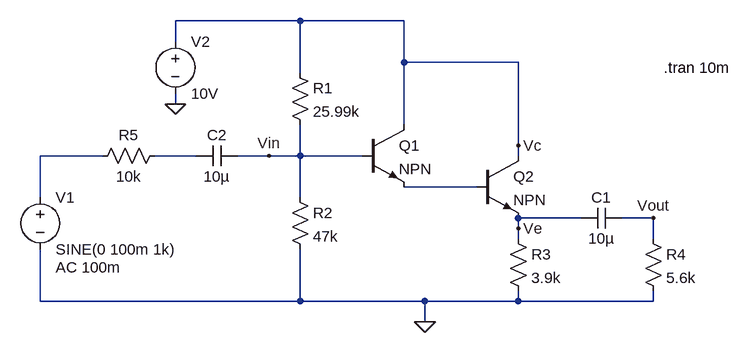
[diagram p0: schematic Darlington - Transient Analysis.asc]
Darlington - Transient Analysis.asc, the LTspice schematic file:
Version 4
SHEET 1 1452 680
WIRE 368 -64 176 -64
WIRE 528 -64 368 -64
WIRE 176 -32 176 -64
WIRE 528 0 528 -64
WIRE 704 0 528 0
WIRE 368 16 368 -64
WIRE 176 64 176 48
WIRE 528 96 528 0
WIRE 704 128 704 0
WIRE 64 144 -32 144
WIRE 208 144 144 144
WIRE 320 144 272 144
WIRE 368 144 368 96
WIRE 368 144 320 144
WIRE 464 144 368 144
WIRE 704 144 704 128
WIRE 640 192 528 192
WIRE -32 208 -32 144
WIRE 368 208 368 144
WIRE 800 240 704 240
WIRE 912 240 864 240
WIRE 704 256 704 240
WIRE 704 272 704 256
WIRE 912 272 912 240
WIRE -32 368 -32 288
WIRE 368 368 368 288
WIRE 368 368 -32 368
WIRE 560 368 368 368
WIRE 704 368 704 352
WIRE 704 368 560 368
WIRE 912 368 912 352
WIRE 912 368 704 368
WIRE 560 400 560 368
FLAG 176 64 0
FLAG 560 400 0
FLAG 704 128 Vc
FLAG 704 256 Ve
FLAG 912 240 Vout
FLAG 320 144 Vin
SYMBOL voltage -32 192 R0
WINDOW 123 24 124 Left 2
WINDOW 39 0 0 Left 0
SYMATTR Value2 AC 100m
SYMATTR InstName V1
SYMATTR Value SINE(0 100m 1k)
SYMBOL voltage 176 -48 R0
SYMATTR InstName V2
SYMATTR Value 10V
SYMBOL res 352 0 R0
SYMATTR InstName R1
SYMATTR Value 25.99k
SYMBOL res 352 192 R0
SYMATTR InstName R2
SYMATTR Value 47k
SYMBOL res 688 256 R0
SYMATTR InstName R3
SYMATTR Value 3.9k
SYMBOL res 896 256 R0
SYMATTR InstName R4
SYMATTR Value 5.6k
SYMBOL res 160 128 R90
WINDOW 0 0 56 VBottom 2
WINDOW 3 32 56 VTop 2
SYMATTR InstName R5
SYMATTR Value 10k
SYMBOL npn 464 96 R0
SYMATTR InstName Q1
SYMBOL npn 640 144 R0
SYMATTR InstName Q2
SYMBOL cap 864 224 R90
WINDOW 0 0 32 VBottom 2
WINDOW 3 32 32 VTop 2
SYMATTR InstName C1
SYMATTR Value 10µ
SYMBOL cap 272 128 R90
WINDOW 0 0 32 VBottom 2
WINDOW 3 32 32 VTop 2
SYMATTR InstName C2
SYMATTR Value 10µ
TEXT 928 8 Left 2 !.tran 10m

The netlist it stands for:
* Darlington - Transient Analysis.asc
V1 N001 0 SINE(0 100m 1k) AC 100m
V2 Vc 0 10V
R1 Vc Vin 25.99k
R2 Vin 0 47k
R3 Ve 0 3.9k
R4 Vout 0 5.6k
R5 N002 N001 10k
Q1 Vc Vin N003 0 NPN
Q2 Vc N003 Ve 0 NPN
C1 Vout Ve 10µ
C2 Vin N002 10µ
.model NPN NPN
.model PNP PNP
.lib standard.bjt
.tran 10m
.backanno
.end